# EAGLE design toolbox (EAGLE 7.4.0)
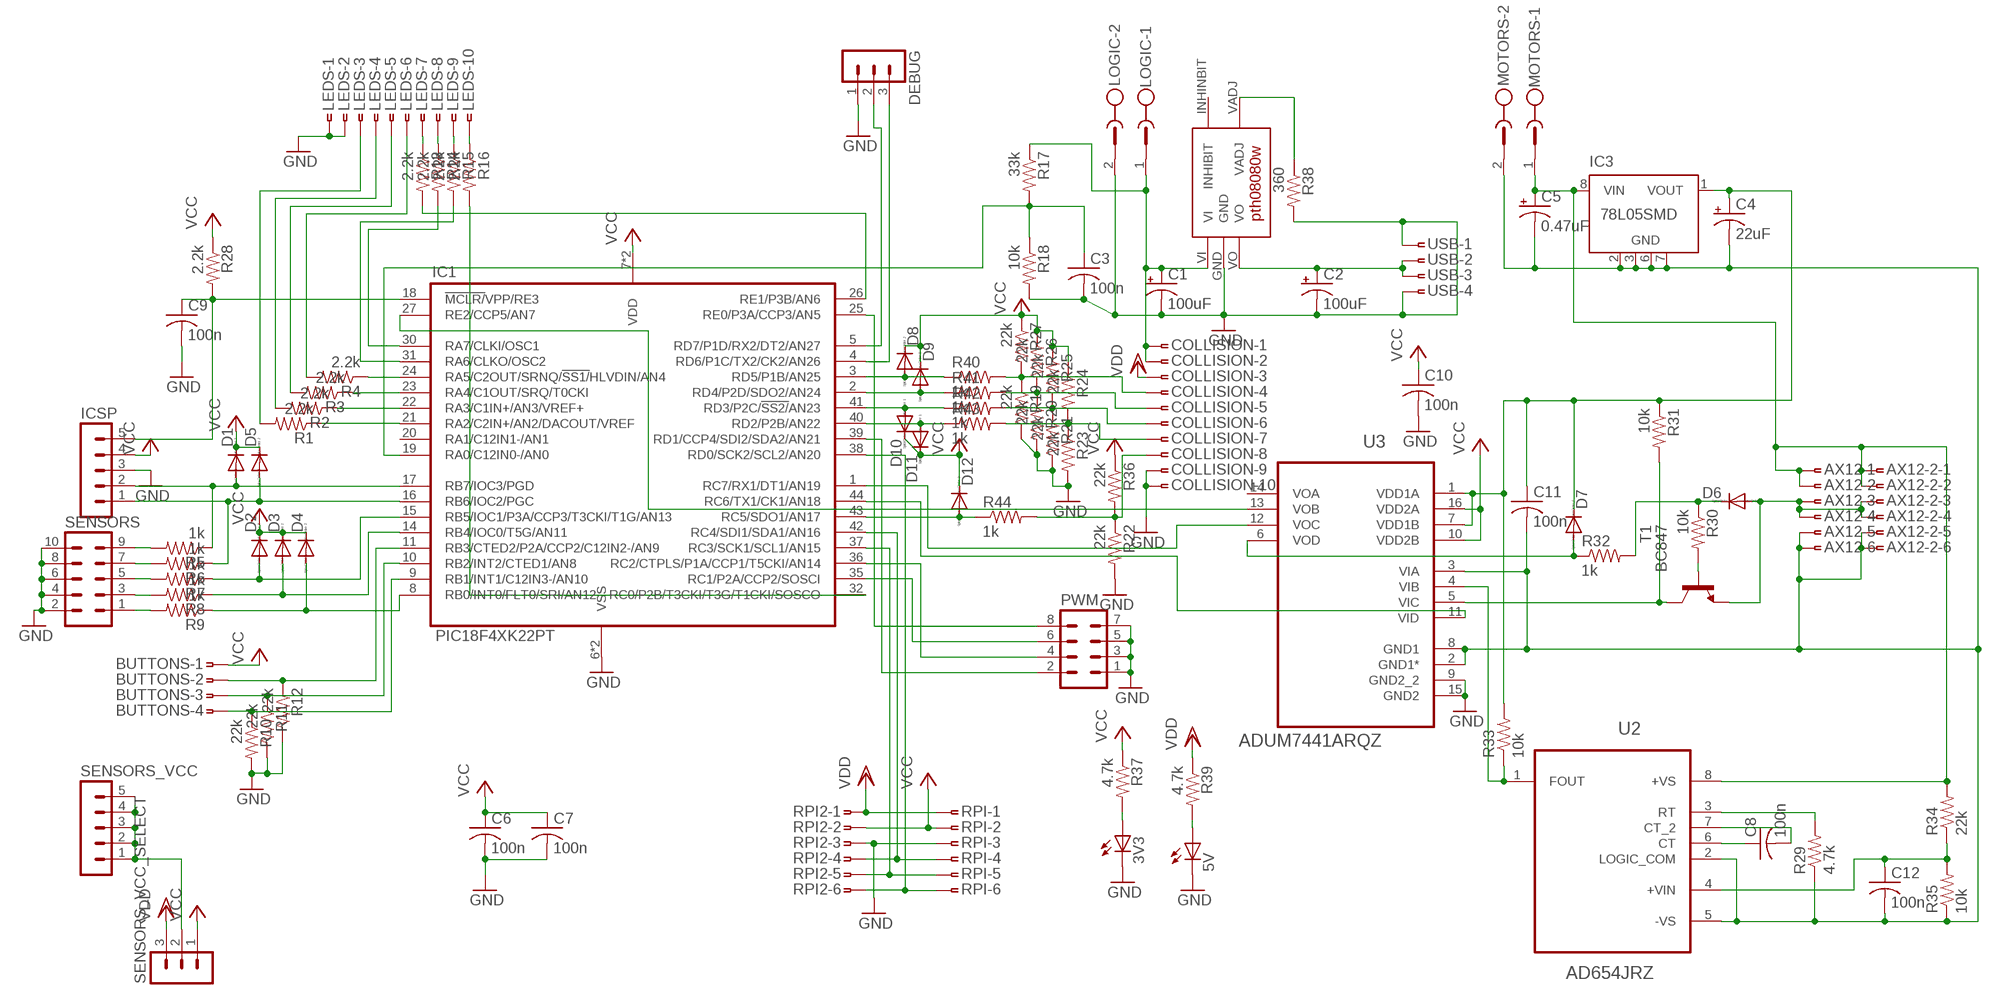
[diagram p0: schematic, sheet 1]

## Parts
3V3  LEDCHIPLED_0805  [CHIPLED_0805]
5V  LEDCHIPLED_0805  [CHIPLED_0805]
AX12  SMDTOP-6  [SMDTOP6]
AX12-2  SMDTOP-6  [SMDTOP6]
BUTTONS  SMDTOP-4  [SMDTOP4]
C1  100uF  CPOL-USE2,5-6E  [E2,5-6E]
C2  100uF  CPOL-USE2,5-6E  [E2,5-6E]
C3  100n  C-USC0805  [C0805]
C4  22uF  CPOL-USE2-5  [E2-5]
C5  0.47uF  CPOL-USE2-5  [E2-5]
C6  100n  C-USC0805  [C0805]
C7  100n  C-USC0805  [C0805]
C8  100n  C-USC0805  [C0805]
C9  100n  C-USC0805  [C0805]
C10  100n  C-USC0805  [C0805]
C11  100n  C-USC0805  [C0805]
C12  100n  C-USC0805  [C0805]
COLLISION  SMDTOP-10  [SMDTOP10]
D1  DIODE-SOD523  [SOD523]
D2  DIODE-SOD523  [SOD523]
D3  DIODE-SOD523  [SOD523]
D4  DIODE-SOD523  [SOD523]
D5  DIODE-SOD523  [SOD523]
D6  DIODE-SOD523  [SOD523]
D7  DIODE-SOD523  [SOD523]
D8  DIODE-SOD523  [SOD523]
D9  DIODE-SOD523  [SOD523]
D10  DIODE-SOD523  [SOD523]
D11  DIODE-SOD523  [SOD523]
D12  DIODE-SOD523  [SOD523]
DEBUG  MA03-1  [MA03-1]
IC1  PIC18F4XK22PT  [TQFP44]
IC3  78L05SMD  [SO08]
ICSP  MA05-1  [MA05-1]
LEDS  SMDTOP-10  [SMDTOP10]
LOGIC  MSTBV2  [MSTBV2]
MOTORS  MSTBV2  [MSTBV2]
PWM  MA04-2  [MA04-2]
R1  2.2k  R-US_M0805  [M0805]
R2  2.2k  R-US_M0805  [M0805]
R3  2.2k  R-US_M0805  [M0805]
R4  2.2k  R-US_M0805  [M0805]
R5  1k  R-US_M0805  [M0805]
R6  1k  R-US_M0805  [M0805]
R7  1k  R-US_M0805  [M0805]
R8  1k  R-US_M0805  [M0805]
R9  1k  R-US_M0805  [M0805]
R10  22k  R-US_M0805  [M0805]
R11  22k  R-US_M0805  [M0805]
R12  22k  R-US_M0805  [M0805]
R13  2.2k  R-US_M0805  [M0805]
R14  2.2k  R-US_M0805  [M0805]
R15  2.2k  R-US_M0805  [M0805]
R16  2.2k  R-US_M0805  [M0805]
R17  33k  R-US_M0805  [M0805]
R18  10k  R-US_M0805  [M0805]
R19  22k  R-US_M0805  [M0805]
R20  22k  R-US_M0805  [M0805]
R21  22k  R-US_M0805  [M0805]
R22  22k  R-US_M0805  [M0805]
R23  22k  R-US_M0805  [M0805]
R24  22k  R-US_M0805  [M0805]
R25  22k  R-US_M0805  [M0805]
R26  22k  R-US_M0805  [M0805]
R27  22k  R-US_M0805  [M0805]
R28  2.2k  R-US_M0805  [M0805]
R29  4.7k  R-US_M0805  [M0805]
R30  10k  R-US_M0805  [M0805]
R31  10k  R-US_M0805  [M0805]
R32  1k  R-US_M0805  [M0805]
R33  10k  R-US_M0805  [M0805]
R34  22k  R-US_M0805  [M0805]
R35  10k  R-US_M0805  [M0805]
R36  22k  R-US_M0805  [M0805]
R37  4.7k  R-US_M0805  [M0805]
R38  360  R-US_M0805  [M0805]
R39  4.7k  R-US_M0805  [M0805]
R40  1k  R-US_M0805  [M0805]
R41  1k  R-US_M0805  [M0805]
R42  1k  R-US_M0805  [M0805]
R43  1k  R-US_M0805  [M0805]
R44  1k  R-US_M0805  [M0805]
RPI  SMDTOP-6  [SMDTOP6]
RPI2  SMDTOP-6  [SMDTOP6]
SENSORS  MA05-2  [MA05-2]
SENSORS_VCC  MA05-1  [MA05-1]
SENSORS_VCC_SELECT  MA03-1  [MA03-1]
T1  BC847  [SOT23]
U2  AD654JRZ  [SOIC127P600X175-8N]
U3  ADUM7441ARQZ  [SOP64P600X175-16N]
U$1  REGUL_PTH  [REGUL_PTH]
USB  SMDTOP-4  [SMDTOP4]

## Nets
GND: 3V3.C 5V.C C1.- C2.- C3.2 C6.2 C7.2 C9.2 C10.2 COLLISION.9 COLLISION.10 DEBUG.1 IC1.6(VSS) IC1.29(VSS) ICSP.3 LEDS.1 LEDS.2 LOGIC.2 PWM.1 PWM.3 PWM.5 PWM.7 R10.2 R11.2 R12.2 R18.2 R19.2 R20.2 R21.2 R22.2 R23.2 R38.2 RPI2.3 RPI.3 SENSORS.2 SENSORS.4 SENSORS.6 SENSORS.8 SENSORS.10 U3.9(GND2_2) U3.15(GND2) U$1.GND USB.1 USB.4
GND_MOTOR: AX12-2.5 AX12-2.6 AX12.5 AX12.6 C4.- C5.- C11.2 C12.2 IC3.2(GND) IC3.3(GND) IC3.6(GND) IC3.7(GND) MOTORS.2 R29.1 R35.1 U2.2(LOGIC_COM) U2.5(-VS) U3.2(GND1*) U3.3(VIA) U3.8(GND1)
N$1: D1.A IC1.17(RB7/IOC3/PGD) ICSP.2 R5.1
N$2: D5.A IC1.16(RB6/IOC2/PGC) ICSP.1 R6.1
N$3: C9.1 IC1.18(!MCLR/!VPP/RE3) ICSP.5 R28.2
N$4: LEDS.6 R4.2
N$5: LEDS.5 R3.2
N$6: LEDS.4 R2.2
N$7: IC1.42(RC4/SDI1/SDA1/AN16) RPI2.4 RPI.4
N$8: IC1.37(RC3/SCK1/SCL1/AN15) RPI2.5 RPI.5
N$9: IC1.38(RD0/SCK2/SCL2/AN20) RPI2.6 RPI.6
N$10: LEDS.3 R1.2
N$11: R5.2 SENSORS.9
N$12: R6.2 SENSORS.7
N$13: R7.2 SENSORS.5
N$14: R8.2 SENSORS.3
N$15: R9.2 SENSORS.1
N$16: D2.A IC1.15(RB5/IOC1/P3A/CCP3/T3CKI/T1G/AN13) R7.1
N$17: D3.A IC1.14(RB4/IOC0/T5G/AN11) R8.1
N$18: D4.A IC1.8(RB0/INT0/FLT0/SRI/AN12) R9.1
N$19: SENSORS_VCC.1 SENSORS_VCC.2 SENSORS_VCC.3 SENSORS_VCC.4 SENSORS_VCC.5 SENSORS_VCC_SELECT.2
N$20: IC1.24(RA5/C2OUT/SRNQ/!SS1/!HLVDIN/AN4) R4.1
N$21: IC1.23(RA4/C1OUT/SRQ/T0CKI) R3.1
N$22: IC1.22(RA3/C1IN+/AN3/VREF+) R2.1
N$23: IC1.21(RA2/C2IN+/AN2/DACOUT/VREF) R1.1
N$24: BUTTONS.4 IC1.9(RB1/INT1/C12IN3-/AN10) R10.1
N$25: BUTTONS.2 IC1.11(RB3/CTED2/P2A/CCP2/C12IN2-/AN9) R12.1
N$26: BUTTONS.3 IC1.10(RB2/INT2/CTED1/AN8) R11.1
N$27: IC1.31(RA6/CLKO/OSC2) R15.2
N$28: IC1.30(RA7/CLKI/OSC1) R14.2
N$29: IC1.32(RC0/P2B/T3CKI/T3G/T1CKI/SOSCO) R16.2
N$30: IC1.26(RE1/P3B/AN6) R13.2
N$31: LEDS.10 R16.1
N$32: LEDS.9 R15.1
N$33: LEDS.8 R14.1
N$34: LEDS.7 R13.1
N$35: C1.+ COLLISION.1 COLLISION.2 LOGIC.1 R17.1 U$1.VI
N$36: DEBUG.2 IC1.5(RD7/P1D/RX2/DT2/AN27)
N$37: C2.+ U$1.VO USB.2 USB.3
N$38: DEBUG.3 IC1.4(RD6/P1C/TX2/CK2/AN26)
N$39: C3.1 IC1.19(RA0/C12IN0-/AN0) R17.2 R18.1
N$40: IC1.35(RC1/P2A/CCP2/SOSCI) PWM.6
N$41: COLLISION.4 R19.1 R27.2 R40.2
N$42: COLLISION.5 R20.1 R26.2 R41.2
N$43: COLLISION.6 R21.1 R25.2 R42.2
N$44: COLLISION.7 R23.1 R24.2 R43.2
N$45: COLLISION.8 R22.1 R36.2 R44.2
N$46: IC1.36(RC2/CTPLS/P1A/CCP1/T5CKI/AN14) PWM.4
N$47: IC1.25(RE0/P3A/CCP3/AN5) PWM.8
N$48: IC1.39(RD1/CCP4/SDI2/SDA2/AN21) PWM.2
N$49: C12.1 R34.1 R35.2 U2.4(+VIN)
N$50: C8.1 U2.6(CT)
N$51: R30.2 T1.1(B)
N$52: AX12-2.3 AX12-2.4 AX12.3 AX12.4 D6.A T1.2(E)
N$53: D6.C R30.1 R32.2
N$54: IC1.1(RC7/RX1/DT1/AN19) U3.12(VOC)
N$55: R31.2 T1.3(C) U3.5(VIC)
N$56: IC1.44(RC6/TX1/CK1/AN18) U3.11(VID)
N$57: IC1.27(RE2/CCP5/AN7) U3.13(VOB)
N$58: R38.1 U$1.VADJ
N$59: D7.A R32.1 U3.6(VOD)
N$60: 3V3.A R37.2
N$61: AX12-2.1 AX12-2.2 AX12.1 AX12.2 C5.+ IC3.8(VIN) MOTORS.1 R34.2 U2.8(+VS)
N$62: C8.2 U2.7(CT_2)
N$63: R33.1 U2.1(FOUT) U3.4(VIB)
N$64: 5V.A R39.2
N$65: R29.2 U2.3(RT)
N$66: D12.A IC1.43(RC5/SDO1/AN17) R44.1
N$67: D8.A IC1.3(RD5/P1B/AN25) R40.1
N$68: C4.+ C11.1 D7.C IC3.1(VOUT) R31.1 R33.2 U3.1(VDD1A) U3.7(VDD1B)
N$69: D9.A IC1.2(RD4/P2D/SDO2/AN24) R41.1
N$70: D10.A IC1.41(RD3/P2C/!SS2/!AN23) R42.1
N$71: D11.A IC1.40(RD2/P2B/AN22) R43.1
VCC: BUTTONS.1 C6.1 C7.1 C10.1 D1.C D2.C D3.C D4.C D5.C D8.C D9.C D10.C D11.C D12.C IC1.7(VDD) IC1.28(VDD) ICSP.4 R24.1 R25.1 R26.1 R27.1 R28.1 R36.1 R37.1 RPI2.2 RPI.2 SENSORS_VCC_SELECT.1 U3.10(VDD2B) U3.16(VDD2A)
VDD: COLLISION.3 R39.1 RPI2.1 RPI.1 SENSORS_VCC_SELECT.3
Unconnected: IC1.20(RA1/C12IN1-/AN1) IC3.4(NC) IC3.5(NC) U3.14(VOA) U$1.INHINBIT(INHIBIT)

## Library data of the parts
3V3 5V = adafruit:LED: LED OSRAM: - CHIPLED LG R971, LG N971, LY N971, LG Q971, LY Q971, LO R971, LY R971 LH N974, LH R974 LS Q976, LO Q976, LY Q976 LO Q996 - Hyper CHIPLED LW Q18S LB Q993, LB Q99A, LB R99A - SideLED LS A670, LO A670, LY A670, LG A670, LP A670 LB A673, LV A673, LT A673, LW A673 LH A674 LY A675 LS A676, LA A676, LO A676, LY A676, LW A676 LS A679, LY A679, LG A679 - Hyper Micro SIDELED® LS Y876, LA Y876, LO Y876, LY Y876 LT Y87S - SmartLED LW L88C, LW L88S LB L89C, LB L89S, LG L890 LS L89K, LO L89K, LY L89K LS L896, LA L896, LO L896, LY L896 - TOPLED LS T670, LO T670, LY T670, LG T670, LP T670 LSG T670, LSP T670, LSY T670, LOP T670, LYG T670 LG T671, LOG T671, LSG T671 LB T673, LV T673, LT T673, LW T673 LH T674 LS T676, LA T676, LO T676, LY T676, LB T676, LH T676, LSB T676, LW T676 LB T67C, LV T67C, LT T67C, LS T67K, LO T67K, LY T67K, LW E67C LS E67B, LA E67B, LO E67B, LY E67B, LB E67C, LV E67C, LT E67C LW T67C LS T679, LY T679, LG T679 LS T770, LO T770, LY T770, LG T770, LP T770 LB T773, LV T773, LT T773, LW T773 LH T774 LS E675, LA E675, LY E675, LS T675 LS T776, LA T776, LO T776, LY T776, LB T776 LHGB T686 LT T68C, LB T68C - Hyper Mini TOPLED® LB M676 - Mini TOPLED Santana® LG M470 LS M47K, LO M47K, LY M47K Source: http://www.osram.convergy.de/
AX12 AX12-2 RPI RPI2 = con-amp:SMDTOP-6: AMP connector
BUTTONS USB = con-amp:SMDTOP-4: AMP connector
C1 C2 C4 C5 = rcl:CPOL-US: POLARIZED CAPACITOR, American symbol
C3 C6-C12 = rcl:C-US: CAPACITOR, American symbol
COLLISION LEDS = con-amp:SMDTOP-10: AMP connector
D1-D12 = diode:DIODE-: DIODE
DEBUG SENSORS_VCC_SELECT = con-lstb:MA03-1: PIN HEADER; OC_FARNELL: unknown; OC_NEWARK: unknown
IC1 = microchip-pic18f4xk22:PIC18F4XK22: The library has been designed by Richard Magdycz <https://www.facebook.com/groups/eaglecadsoftUK>
IC3 = linear:78L*SMD: Positive VOLTAGE REGULATOR
ICSP SENSORS_VCC = con-lstb:MA05-1: PIN HEADER; OC_FARNELL: unknown; OC_NEWARK: unknown
LOGIC MOTORS = con-phoenix-500:MSTBV2: PHOENIX; OC_FARNELL: unknown; OC_NEWARK: unknown
PWM = con-lstb:MA04-2: PIN HEADER; OC_FARNELL: unknown; OC_NEWARK: unknown
R1-R44 = rcl:R-US_: RESISTOR, American symbol
SENSORS = con-lstb:MA05-2: PIN HEADER; OC_FARNELL: unknown; OC_NEWARK: unknown
T1 = transistor:BC847: NPN TRANSISTOR
U2 = AD654:AD654JRZ: Low Cost Monolithic Voltage-to-Frequency Converter; MPN: AD654JRZ; OC_FARNELL: 9605363; OC_NEWARK: 59K4468; PACKAGE: SOIC-8; SUPPLIER: Analog Devices
U3 = ADUM7441:ADUM7441ARQZ: 1 kV RMS Quad-Channel Digital Isolators; MPN: ADUM7441ARQZ; OC_FARNELL: 1827343; OC_NEWARK: 52R8099; PACKAGE: SOP-16; SUPPLIER: Analog Devices
U$1 = regul_pth:REGUL_PTH: "adjustable voltage regulator pth08080w"

## Board
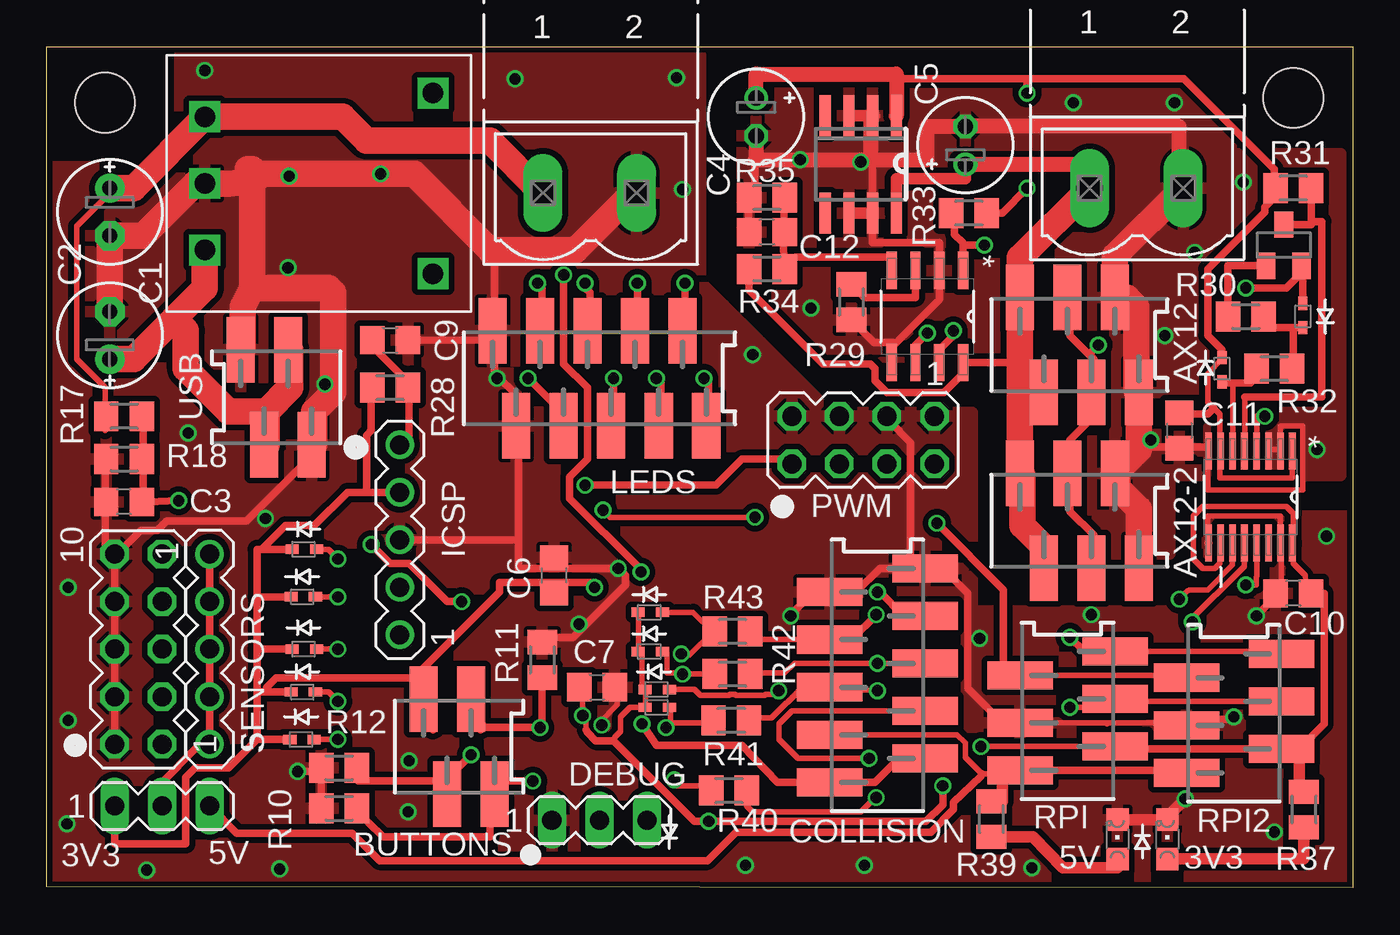
[diagram p1: board, top side]
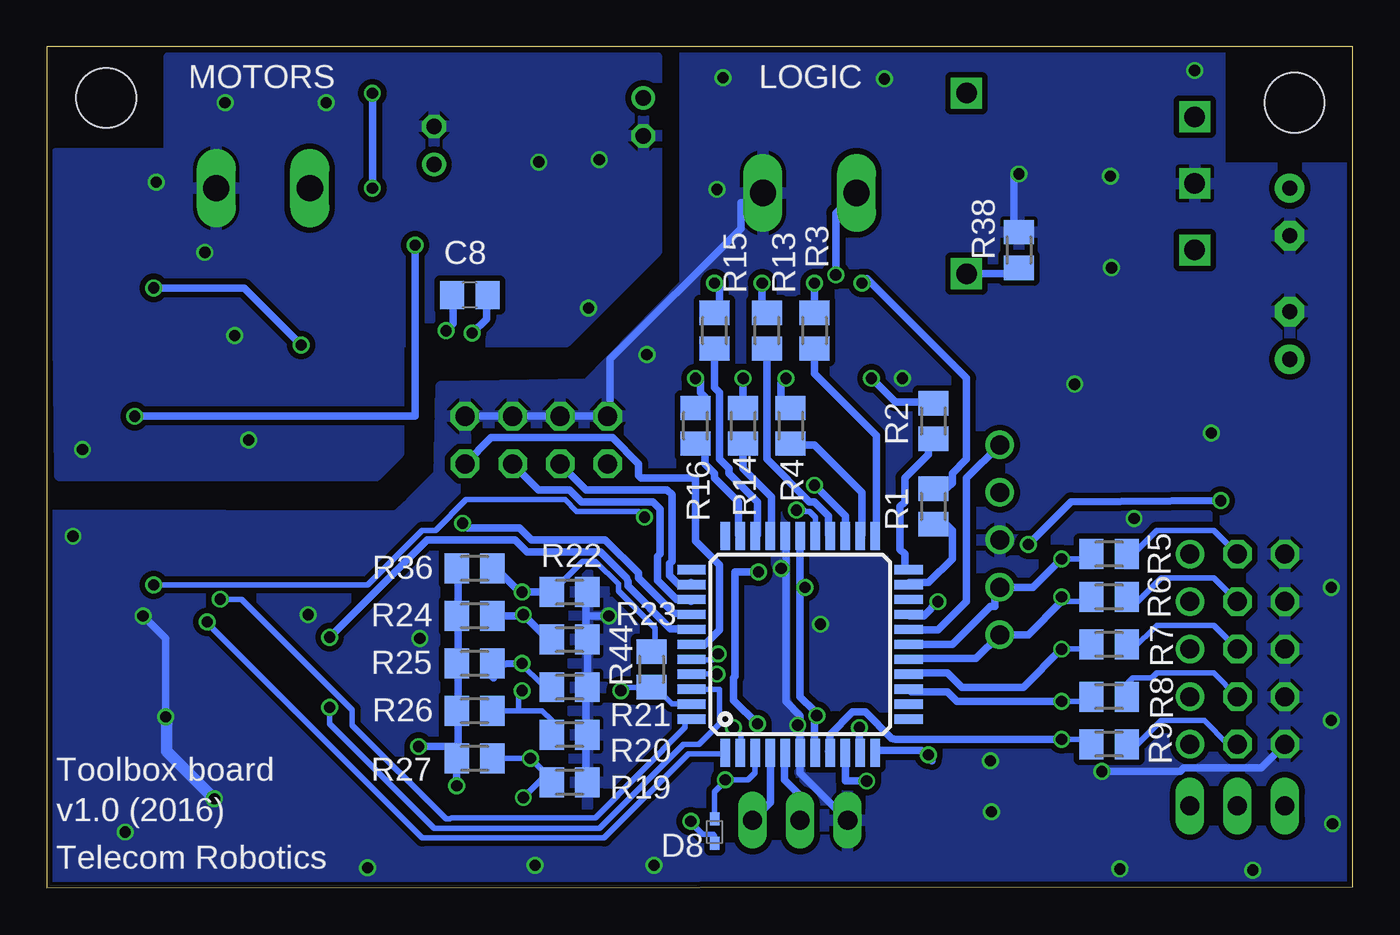
[diagram p2: board, bottom side, seen from below]

Size 69.79 x 44.96 mm. Coordinates in mm from the lower left corner, seen from the top.
Outline: 0,44.96 69.79,44.96 69.79,0 0,0.06 0,44.96
Copper layers (1*16): Top 0.018mm / dielectric 1.55mm / Bottom 0.018mm
Design rules "eurocircuit": minimum track width 0.15mm, minimum drill 0.35mm, track to track 0.15mm, track to pad 0.15mm, pad to pad 0.15mm, via to via 0.15mm, smd to smd 0mil, copper to edge 0.25mm, drill to drill 0.35mm, minimum pad ring 0.175mm, minimum via ring 0.125mm, stop-mask expansion 0mil, vias tented up to drill 0.45mm, thermal gap 0.2mm
Holes 3.2 mm at 3.11,41.97 66.61,42.23

### Footprints (pad centres in the part's own frame; a part is rotated, then mirrored left to right if it is on the bottom)
CHIPLED_0805 = smd 1.2 x 1.2: A 0,-1.05; C 0,1.05
SMDTOP6 = smd 1.5 x 3.5: 1 -3.175,2.54; 2 -1.905,-2.54; 3 -0.635,2.54; 4 0.635,-2.54; 5 1.905,2.54; 6 3.175,-2.54
SMDTOP4 = smd 1.5 x 3.5: 1 -1.905,2.54; 2 -0.635,-2.54; 3 0.635,2.54; 4 1.905,-2.54
E2,5-6E = drill 0.813 pad 1.575: + -1.27,0 | drill 0.813 pad 1.575 octagon: - 1.27,0
C0805 = smd 1.3 x 1.5: 1 -0.95,0; 2 0.95,0
E2-5 = drill 0.813 pad 1.27: + -1.016,0 | drill 0.813 pad 1.27 octagon: - 1.016,0
SMDTOP10 = smd 1.5 x 3.5: 1 -5.715,2.54; 2 -4.445,-2.54; 3 -3.175,2.54; 4 -1.905,-2.54; 5 -0.635,2.54; 6 0.635,-2.54; 7 1.905,2.54; 8 3.175,-2.54; 9 4.445,2.54; 10 5.715,-2.54
SOD523 = smd 0.7 x 0.5: A 0.7,0; C -0.6,0
MA03-1 = drill 1.016 long: 1 -2.54,0; 2 0,0; 3 2.54,0
TQFP44 = smd 1.5 x 0.5: 1 -5.8,4; 2 -5.8,3.2; 3 -5.8,2.4; 4 -5.8,1.6; 5 -5.8,0.8; 6 -5.8,0; 7 -5.8,-0.8; 8 -5.8,-1.6; 9 -5.8,-2.4; 10 -5.8,-3.2; 11 -5.8,-4; 23 5.8,-4; 24 5.8,-3.2; 25 5.8,-2.4; 26 5.8,-1.6; 27 5.8,-0.8; 28 5.8,0; 29 5.8,0.8; 30 5.8,1.6; 31 5.8,2.4; 32 5.8,3.2; 33 5.8,4 | smd 0.5 x 1.5: 12 -4,-5.8; 13 -3.2,-5.8; 14 -2.4,-5.8; 15 -1.6,-5.8; 16 -0.8,-5.8; 17 0,-5.8; 18 0.8,-5.8; 19 1.6,-5.8; 20 2.4,-5.8; 21 3.2,-5.8; 22 4,-5.8; 34 4,5.8; 35 3.2,5.8; 36 2.4,5.8; 37 1.6,5.8; 38 0.8,5.8; 39 0,5.8; 40 -0.8,5.8; 41 -1.6,5.8; 42 -2.4,5.8; 43 -3.2,5.8; 44 -4,5.8
SO08 = smd 0.6 x 2.2: 1 -1.905,-2.6; 2 -0.635,-2.6; 3 0.635,-2.6; 4 1.905,-2.6; 5 1.905,2.6; 6 0.635,2.6; 7 -0.635,2.6; 8 -1.905,2.6
MA05-1 = drill 1.016: 1 -5.08,0; 2 -2.54,0; 3 0,0; 4 2.54,0; 5 5.08,0
MSTBV2 = drill 1.397 long: 1 -2.5,0; 2 2.5,0
MA04-2 = drill 1.016 octagon: 1 -3.81,-1.27; 2 -3.81,1.27; 3 -1.27,-1.27; 4 -1.27,1.27; 5 1.27,-1.27; 6 1.27,1.27; 7 3.81,-1.27; 8 3.81,1.27
M0805 = smd 1.3 x 1.6: 1 -0.95,0; 2 0.95,0
MA05-2 = drill 1.016 octagon: 1 -5.08,-1.27; 2 -5.08,1.27; 3 -2.54,-1.27; 4 -2.54,1.27; 5 0,-1.27; 6 0,1.27; 7 2.54,-1.27; 8 2.54,1.27; 9 5.08,-1.27; 10 5.08,1.27
SOT23 = smd 1 x 1.4: 1 -0.95,-1.1; 2 0.95,-1.1; 3 0,1.1
SOIC127P600X175-8N = smd 1.981 x 0.559: 1 -2.464,1.905; 2 -2.464,0.635; 3 -2.464,-0.635; 4 -2.464,-1.905; 5 2.464,-1.905; 6 2.464,-0.635; 7 2.464,0.635; 8 2.464,1.905
SOP64P600X175-16N = smd 1.981 x 0.356: 1 -2.464,2.235; 2 -2.464,1.6; 3 -2.464,0.965; 4 -2.464,0.33; 5 -2.464,-0.33; 6 -2.464,-0.965; 7 -2.464,-1.6; 8 -2.464,-2.235; 9 2.464,-2.235; 10 2.464,-1.6; 11 2.464,-0.965; 12 2.464,-0.33; 13 2.464,0.33; 14 2.464,0.965; 15 2.464,1.6; 16 2.464,2.235
REGUL_PTH = drill 1.1 square: GND -6.096,1.27; INHINBIT 6.096,6.096; VADJ 6.096,-3.556; VI -6.096,4.826; VO -6.096,-2.286

### Placement (x,y rotation side)
3V3  59.88,2.6 0 top
5V  57.21,2.6 0 top
AX12  55.18,29.02 0 top
AX12-2  55.18,19.62 0 top
BUTTONS  22.03,7.56 0 top
C1  3.37,36.13 270 top
C2  3.37,29.53 90 top
C3  4.13,20.64 180 top
C4  37.91,41.21 270 top
C5  49.09,39.69 90 top
C6  27.11,16.7 90 top
C7  29.4,10.73 0 top
C8  47.18,31.69 180 bottom
C9  18.35,29.27 0 top
C10  66.61,15.75 180 top
C11  60.52,24.45 270 top
C12  38.48,35.05 180 top
COLLISION  44.39,11.37 90 top
D1  13.72,18.1 0 top
D2  13.72,12.76 0 top
D3  13.65,10.48 0 top
D4  13.59,7.94 0 top
D5  13.65,15.56 0 top
D6  67.12,30.54 90 top
D7  62.8,27.75 270 top
D8  34.1,2.98 90 bottom
D9  32.58,9.65 0 top
D10  32.19,12.64 0 top
D11  32.19,14.73 0 top
D12  32.58,10.6 0 top
DEBUG  29.53,3.62 0 top
IC1  29.53,13.02 90 bottom
IC3  43.5,38.67 180 top
ICSP  18.86,18.61 90 top
LEDS  29.53,27.24 0 top
LOGIC  29.02,37.15 0 top
MOTORS  58.23,37.4 0 top
PWM  43.62,23.94 180 top
R1  22.42,20.38 90 bottom
R2  22.42,24.96 90 bottom
R3  28.77,29.78 90 bottom
R4  30.04,24.7 90 bottom
R5  13.02,17.84 0 bottom
R6  13.02,15.56 0 bottom
R7  13.02,13.02 0 bottom
R8  13.02,10.22 0 bottom
R9  13.02,7.68 0 bottom
R10  15.62,4.25 180 top
R11  26.48,12.19 90 top
R12  15.62,6.41 180 top
R13  31.31,29.78 270 bottom
R14  32.58,24.7 270 bottom
R15  34.1,29.78 270 bottom
R16  35.12,24.7 270 bottom
R17  4.13,25.21 0 top
R18  4.13,22.92 180 top
R19  41.85,5.65 0 bottom
R20  41.85,8.19 0 bottom
R21  41.85,10.73 0 bottom
R22  41.85,15.81 0 bottom
R23  41.85,13.27 0 bottom
R24  46.93,14.54 0 bottom
R25  46.93,12 0 bottom
R26  46.93,9.46 0 bottom
R27  46.93,6.92 0 bottom
R28  18.35,26.73 0 top
R29  42.99,31.31 90 top
R30  64.07,30.54 180 top
R31  66.61,37.4 0 top
R32  65.6,27.75 0 top
R33  49.28,36.07 0 top
R34  38.48,33.08 180 top
R35  38.48,36.89 0 top
R36  46.93,17.08 0 bottom
R37  67.18,4.19 270 top
R38  17.84,34.1 90 bottom
R39  50.48,3.68 270 top
R40  36.45,5.21 0 top
R41  36.58,8.95 0 top
R42  36.64,11.43 0 top
R43  36.64,13.72 0 top
R44  37.47,11.68 90 bottom
RPI  54.55,9.46 90 top
RPI2  63.44,9.33 90 top
SENSORS  4.89,12.76 90 top
SENSORS_VCC  8.7,12.76 270 top
SENSORS_VCC_SELECT  6.16,4.38 0 top
T1  66.1,34.35 0 top
U2  47.05,30.54 270 top
U3  64.33,20.89 270 top
U$1  14.54,36.39 0 top
USB  12.26,26.23 180 top

### Tracks (layer width: path | path; a pad name or v marks a point on that pad's centre or on a via)
GND  (via drill 0.6)
  Top 0.305: 62.04,18.43 62.04,19.88 65.93,19.88 U3.15 65.98,18.35 65.98,16.26 65.66,15.24 65.66,15.94 C10.2 | C7.2 30.48,10.92 30.48,9.78 29.53,8.83 v29.65,8.7 | 27.11,17.08 27.11,17.46 26.99,17.59 27.11,17.72 C6.2 | RPI.3 56.58,8.83 56.64,8.76 56.71,8.83 59.63,8.83 | 44.9,25.02 PWM.3 | 46.1,17.27 COLLISION.10
  Top 0.406: U3.9 62.04,18.43 | 3.11,20.64 3.11,22.92 R18.2 | SENSORS.10 3.11,18.35 3.11,20.64 | 3.11,20.64 C3.2 | SENSORS.10 SENSORS.8 SENSORS.6 SENSORS.4 SENSORS.2 | 25.21,24.7 25.21,26.23 23.94,27.5 23.94,29.78 | C9.2 23.18,29.27 23.69,29.78 LEDS.1 23.94,29.78 | 23.94,29.78 23.94,33.59 23.69,34.1 | 25.21,24.7 25.21,18.61 | 25.21,18.61 25.21,17.08 27.11,17.08 v30.54,17.08 30.92,16.7 30.92,16.19 28.13,13.4 26.48,13.4 R11.2 | 25.21,24.7 LEDS.2 | 25.21,18.61 ICSP.3 | COLLISION.10 44.51,17.08 43.24,15.81 COLLISION.9 40.96,15.81 40.01,14.86 40.01,14.73 39.81,14.54 v39.75,14.54 | 59.63,8.83 59.75,8.7 RPI2.3 62.04,8.7 62.36,9.02 63.44,9.02 v63.44,9.14 | v64.64,14.54 65.34,15.24 65.41,15.81 C10.2 | SENSORS.10 3.81,17.91 5.02,19.11 5.91,19.11 6.41,19.62 10.67,19.62 14.03,22.99 USB.1 | COLLISION.10 46.16,17.4 46.16,23.81 45.02,24.96 PWM.3 | COLLISION.10 47.88,17.08 49.21,15.75 49.21,10.67 51.05,8.83 RPI.3 | R10.2 R12.2 14.48,6.22 v13.4,6.22
  Top 0.61: 5V.C 3V3.C 60.01,3.94 v60.83,4.76
  Top 1.422: C2.- C1.- 5.14,34.86 7.94,37.66 U$1.GND 9.72,37.66 11.11,37.78 | 11.11,37.78 11.24,38.16 v17.84,38.16 19.62,38.16 23.69,34.1 28.26,34.1 31.3,37.15 LOGIC.2 | 10.99,32.07 10.99,38.42 10.73,38.42 11.11,37.78 | 10.99,32.07 10.48,31.05 10.48,28.77 USB.4 | USB.1 14.29,23.69 14.29,25.46 15.3,26.48 15.3,31.81 15.05,32.07 10.99,32.07
  Bottom 0.305: v29.65,8.7 29.53,8.7
  Bottom 0.406: R38.2 17.84,34.86 18.1,35.12 18.1,38.16 v17.84,38.16 | 30.29,17.08 30.29,18.61 IC1.29 | 30.29,17.08 30.29,9.97 29.53,9.21 29.53,8.7 IC1.6 29.53,6.16 DEBUG.1 | 30.29,17.08 v30.54,17.08 | PWM.1 PWM.3 PWM.5 PWM.7 39.69,25.34 39.69,28.26 32.7,35.24 32.7,36.64 32.07,36.64 31.69,37.02 LOGIC.2 31.56,37.15 | R19.2 40.96,5.65 40.96,8.19 R20.2 40.96,8.32 40.96,10.73 R21.2 40.89,10.92 40.89,13.08 R23.2 40.96,13.27 40.96,14.54 | 40.96,14.54 40.96,15.81 R22.2 | v63.44,9.14 63.44,13.33 v64.64,14.54 | 40.96,14.54 v39.75,14.54 | v13.4,6.22 9.21,6.22 9.02,6.41 4.89,6.41 SENSORS.2
  Bottom 0.61: v60.83,4.76 63.37,7.3 63.37,8.95 v63.44,9.14
  other vias: 19.37,6.79 19.3,4.06 49.85,13.33 11.68,19.75 1.14,16.07 1.14,8.95 1.08,3.43 5.33,0.95 12.45,1.02 37.34,1.21 43.69,1.21 52.64,1.08 65.6,2.98 55.82,14.6 12.89,33.15 12.95,38.04 8.45,43.69 25.02,43.24 33.66,43.31 37.72,28.51 33.97,37.34 24.07,27.24 28.45,14.1 7.56,24.32 14.86,26.92 68.39,18.8
  pour Bottom (isolate 0.305): 69.47,0.38 69.34,19.94 51.12,19.88 50.36,20.57 48.83,22.1 48.7,26.8 40.89,26.92 35.69,32.26 35.69,44.64 7.11,44.58 7.11,38.48 0.32,38.48 0.32,0.38
  pour Top (isolate 0.305): 0.32,0.32 69.41,0.25 69.41,19.88 61.34,19.88 61.34,14.8 49.47,14.8 49.47,25.4 41.91,25.4 34.92,32.38 34.92,44.51 7.11,44.51 7.11,38.54 0.32,38.54 0.38,0.32
GND_MOTOR  (via drill 0.6)
  Top 0.305: U3.8 62.04,23.36 | 62.04,23.36 62.04,21.27 67.12,21.27 67.12,24.7 65.93,24.7 U3.2 | 62.04,23.36 62.04,23.56 62.04,24.19 | 65.85,23.43 65.34,23.43
  Top 0.406: IC3.2 IC3.7 44.13,34.48 47.69,34.48 U2.2 47.69,31.43 45.4,29.15 | U2.5 45.15,28.89 45.4,29.15 | 37.85,38.93 37.85,36.57 R35.1 37.47,34.8 C12.2 | R29.1 44.2,29.15 45.4,29.15 | 65.34,23.43 U3.3 | 65.85,23.43 U3.2 | 62.04,23.56 60.52,23.56 C11.2 60.39,23.56 58.36,23.56
  Top 0.61: IC3.3 IC3.2 | IC3.7 IC3.6
  Top 0.813: IC3.2 44.01,41.27 44.01,38.93 | 44.01,38.93 47.05,38.93 47.05,40.7 C5.- 60.52,40.7 60.52,37.4 MOTORS.2 | C4.- 37.91,38.93 | 37.91,38.93 37.85,38.93 | 37.91,38.93 v40.26,38.93 44.01,38.93
  Top 1.422: MOTORS.2 57.09,33.76 AX12.5 57.72,31.56 58.23,31.05 58.23,26.61 AX12.6 58.36,23.56 58.36,23.43 AX12-2.5 57.21,22.03 57.21,21.4 58.36,20.26 AX12-2.6
  other vias: 43.5,38.8 54.86,41.97 60.26,41.97 63.94,37.72 61.34,33.97 59.75,29.53 58.99,23.94 67.88,23.43 40.83,30.99
  pour Bottom (isolate 0.305): 37.21,44.39 63.25,44.39 63.25,39.24 69.28,39.24 69.09,22.03 52.2,22.03 50.99,23.24 50.99,29.21 42.04,29.21 37.21,34.04
  pour Top (isolate 0.305): 37.15,44.58 37.15,32.58 41.34,28.38 51.44,28.38 51.5,28.32 51.5,17.84 60.01,17.84 60.01,21.97 60.07,21.97 60.07,22.03 69.15,22.03 69.15,39.24 63.31,39.24 63.31,44.58 37.27,44.58
N$1  (via drill 0.6)
  Top 0.305: v15.56,17.59 15.05,18.1 D1.A
  Bottom 0.305: v15.56,17.59 14.54,17.59 14.03,18.1 13.78,17.84 R5.1
  Bottom 0.406: v15.56,17.59 17.08,16.07 ICSP.2 19.11,15.81 19.11,15.05 19.37,15.05 21.4,13.02 IC1.17
N$2  (via drill 0.6)
  Top 0.305: D5.A v15.56,15.56
  Bottom 0.305: 15.56,15.3 14.03,15.3 13.78,15.56 R6.1
  Bottom 0.406: v15.56,15.56 15.56,15.3 17.34,13.53 ICSP.1 20.13,12.26 23.69,12.26 IC1.16
N$3
  Top 0.406: ICSP.5 19.37,24.19 19.37,26.73 | 19.37,26.73 19.37,26.99 17.34,29.02 17.34,29.27 C9.1 | 19.37,26.73 R28.2
  Bottom 0.406: ICSP.5 20.64,21.91 20.64,15.3 22.16,13.78 23.69,13.78 IC1.18
N$4  (via drill 0.6)
  Top 0.406: v30.29,27.24 30.29,24.7 LEDS.6
  Bottom 0.406: v30.29,27.24 30.54,26.99 30.54,25.97 30.04,25.46 R4.2
N$5  (via drill 0.6)
  Top 0.406: LEDS.5 29.02,29.78 29.02,31.81 28.77,32.07 v28.77,32.32
  Bottom 0.406: v28.77,32.32 28.77,31.05 28.51,30.8 28.77,30.54 R3.2
N$6  (via drill 0.6)
  Top 0.406: v25.72,27.24 27.75,25.21 27.75,24.7 LEDS.4
  Bottom 0.406: v25.72,27.24 24.45,25.97 22.42,25.97 R2.2
N$7  (via drill 0.6)
  Top 0.305: RPI2.4 58.67,9.97 | v54.67,9.65 55.5,9.65 55.94,10.1 RPI.4
  Top 0.406: RPI.4 58.55,10.1 58.67,9.97
  Bottom 0.305: v54.67,9.65 54.67,8.76 49.09,3.17 40.26,3.17 35.75,7.68 34.92,7.68 33.85,8.76 33.85,10.6 35.31,10.6 IC1.42
N$8  (via drill 0.6)
  Top 0.305: RPI.5 59.31,11.37
  Top 0.406: v47.56,19.49 51.12,15.94 51.12,11.49 51.24,11.37 RPI.5 | RPI2.5 59.44,11.24 59.31,11.37
  Bottom 0.406: v47.56,19.49 47.31,19.24 44.51,19.24 43.88,18.61 39.94,18.61 38.16,16.83 38.16,16.57 36.26,14.67 35.37,14.67 IC1.37
N$9  (via drill 0.6)
  Top 0.305: 64.71,12.64 RPI.6
  Top 0.406: v54.67,13.4 55.44,12.64 RPI.6 | 64.71,12.64 64.83,12.51 RPI2.6
  Bottom 0.406: 35.37,13.78 IC1.38 35.56,13.84 36.45,13.84 38.73,16.13 38.73,16.38 38.8,16.57 40.2,17.97 44.13,17.97 44.77,18.61 49.47,18.61 v54.67,13.4
N$10  (via drill 0.6)
  Top 0.406: v26.23,32.32 26.48,32.07 26.48,29.78 LEDS.3
  Bottom 0.406: R1.2 22.42,21.4 21.65,21.4 21.4,21.65 21.4,22.16 20.64,22.92 20.64,27.24 25.97,32.58 v26.23,32.32
N$11
  Bottom 0.305: SENSORS.9 7.43,19.11 10.48,19.11 12,17.59 12.26,17.84 R5.2
N$12
  Bottom 0.305: SENSORS.7 7.43,16.57 10.22,16.57 11.75,15.05 12.26,15.56 R6.2
N$13
  Bottom 0.305: SENSORS.5 7.43,14.03 10.48,14.03 11.75,12.76 12,12.76 12.26,13.02 R7.2
N$14
  Bottom 0.305: SENSORS.3 7.43,11.49 10.48,11.49 10.73,11.24 11.75,11.24 12,10.99 12,10.22 R8.2
N$15
  Bottom 0.305: SENSORS.1 6.67,7.68 7.94,8.95 10.22,8.95 11.75,7.43 12,7.43 12.26,7.68 R9.2
N$16  (via drill 0.6)
  Top 0.305: D2.A v15.56,12.76
  Bottom 0.305: v15.56,12.76 14.03,12.76 13.78,13.02 R7.1
  Bottom 0.406: v15.56,12.76 17.59,10.73 20.89,10.73 21.65,11.49 23.69,11.49 IC1.15
N$17  (via drill 0.6)
  Top 0.305: v15.56,9.97 15.05,10.48 D3.A
  Bottom 0.305: R8.1 13.78,10.22 14.03,10.48 14.54,9.97 v15.56,9.97
  Bottom 0.406: v15.56,9.97 21.14,9.97 21.65,10.48 23.59,10.48 IC1.14
N$18  (via drill 0.6)
  Top 0.305: D4.A v15.56,7.94
  Bottom 0.305: R9.1 13.78,7.68 14.03,7.43 14.54,7.94 v15.56,7.94
  Bottom 0.406: v15.56,7.94 24.45,7.94 24.64,8 26.04,9.4 26.73,9.4 27.94,8.19 27.94,7.49 IC1.8 28,7.29
N$19
  Top 0.406: SENSORS_VCC.1 SENSORS_VCC.2 SENSORS_VCC.3 SENSORS_VCC.4 SENSORS_VCC.5 8.45,7.43 7.94,7.43 6.16,5.65 SENSORS_VCC_SELECT.2
N$20
  Bottom 0.406: IC1.24 26.23,18.86 26.23,21.15 28.77,23.69 30.04,23.69 R4.1
N$21
  Bottom 0.406: R3.1 28.77,27.5 25.46,24.19 25.46,18.86 IC1.23
N$22
  Bottom 0.406: IC1.22 23.94,17.08 23.94,17.84 24.19,18.1 24.19,20.38 23.94,20.64 23.94,21.91 22.67,23.18 22.67,23.94 22.42,24.19 R2.1
N$23
  Bottom 0.406: R1.1 22.42,19.37 21.65,19.37 21.4,19.11 21.4,17.59 22.67,16.32 23.69,16.32 IC1.21
N$24  (via drill 0.6)
  Top 0.406: R10.1 17.21,3.49 17.97,2.73 23.69,2.73 23.69,3.62 23.94,3.87 BUTTONS.4 24.13,5.08 24.07,5.72 v25.97,5.72
  Bottom 0.406: v25.97,5.72 27.11,5.72 27.11,7.18 IC1.9
N$25  (via drill 0.6)
  Top 0.406: v22.67,7.11 21.4,5.84 BUTTONS.2 21.21,5.72 16.64,5.72 16.57,5.78 R12.1
  Bottom 0.406: IC1.11 25.59,7.24 25.46,7.37 23.05,7.37 22.48,6.79 22.48,6.92 v22.67,7.11
N$26  (via drill 0.6)
  Top 0.406: 23.18,9.97 23.18,8.45 BUTTONS.3 23.37,8.57 v26.35,8.57 | 26.48,11.49 R11.1 26.48,8.76 v26.35,8.57 | v26.35,8.57 26.42,8.57
  Bottom 0.406: v26.35,8.57 26.35,7.24 IC1.10
N$27
  Bottom 0.406: R15.2 34.1,29.02 33.85,28.77 34.1,28.51 34.1,26.73 33.85,26.48 33.85,22.92 33.34,22.42 33.34,22.16 31.81,20.64 31.81,18.86 IC1.31
N$28
  Bottom 0.406: R14.2 32.58,22.42 31.05,20.89 31.05,18.86 IC1.30
N$29
  Bottom 0.406: R16.2 35.12,23.69 34.61,23.18 34.61,22.67 34.1,22.16 34.1,21.91 32.83,20.64 32.83,18.86 IC1.32
N$30
  Bottom 0.406: R13.2 31.3,29.02 31.56,28.77 31.3,28.51 31.3,22.92 29.02,20.64 28.77,20.64 28,19.88 28,18.86 IC1.26
N$31  (via drill 0.6)
  Top 0.406: v35.12,27.24 35.37,26.99 35.37,24.7 LEDS.10
  Bottom 0.406: R16.1 35.12,25.46 34.61,25.97 34.61,26.23 34.86,26.48 34.86,27.24 v35.12,27.24
N$32  (via drill 0.6)
  Top 0.406: v34.1,32.32 34.1,29.78 LEDS.9
  Bottom 0.406: R15.1 34.1,30.54 33.85,30.8 33.85,32.32 v34.1,32.32
N$33  (via drill 0.6)
  Top 0.406: v32.58,27.24 32.83,26.99 32.83,24.7 LEDS.8
  Bottom 0.406: v32.58,27.24 R14.1
N$34  (via drill 0.6)
  Top 0.406: LEDS.7 31.56,29.78 31.56,32.07 31.3,32.32 v31.56,32.32
  Bottom 0.406: v31.56,32.32 31.56,30.8 31.3,30.54 R13.1
N$35  (via drill 0.6)
  Top 0.305: C1.+ 3.11,36.89 1.59,35.37 1.59,28.26 3.11,26.73 3.11,24.45 R17.1
  Top 0.406: COLLISION.2 45.53,6.92 44.26,5.65 COLLISION.1 39.05,5.65 37.15,7.62 32.58,7.62 v31.81,8.76 | v27.62,32.77 27.62,28 28.89,26.73 28.89,22.92 27.94,21.97 27.94,20.83 31.62,17.14 31.69,16.95 v31.75,16.89
  Top 1.422: C1.+ 4.64,37.4 U$1.VI 15.81,41.21 17.08,39.94 23.69,39.94 26.48,37.15 LOGIC.1
  Bottom 0.406: v27.62,32.77 27.62,36.07 26.54,37.15 LOGIC.1 | 31.88,16.83 v31.75,16.89 33.02,16.89 33.02,11.3 33.08,11.24 33.08,10.03 v31.81,8.76
N$36
  Bottom 0.406: DEBUG.2 29.53,4.95 30.35,5.78 30.35,7.18 IC1.5
N$37
  Top 1.422: 6.79,30.42 4.64,28.26 C2.+ | 6.79,30.42 8.45,32.07 U$1.VO | 11.75,25.46 11.75,23.69 USB.3 | 11.75,25.46 13.02,26.73 13.02,28.77 USB.2 | 11.75,25.46 9.72,25.46 7.43,27.75 7.43,29.78 6.79,30.42
N$38
  Bottom 0.406: DEBUG.3 31.11,4.57 31.11,7.18 IC1.4
N$39  (via drill 0.6)
  Top 0.406: 5.14,22.92 5.14,25.21 R17.2 | 5.14,22.92 5.14,20.64 C3.1 4.89,20.64 5.14,20.38 5.4,20.64 v7.05,20.7 | 5.14,22.92 R18.1 | v17.34,18.35 18.35,17.34 19.37,17.34 21.4,15.3 v22.16,15.3
  Bottom 0.406: v7.05,20.7 15.05,20.64 v17.34,18.35 | v22.16,15.3 22.92,14.54 23.69,14.54 IC1.19
N$40
  Bottom 0.406: 35.37,16.32 IC1.35 35.5,16.19 36.01,16.19 36.51,16.7 36.51,17.34 36.39,17.46 36.39,21.02 36.64,21.27 40.96,21.27 PWM.6
N$41  (via drill 0.6)
  Top 0.305: COLLISION.4 39.81,9.46 39.12,8.76 39.12,7.94 40.13,6.92 v43.94,6.92 | R40.2 37.4,4.38 37.72,4.06 43.5,4.06 44.26,4.83 v44.32,4.83
  Bottom 0.305: 43.05,5.97 R19.1 | R19.1 43.12,6.1 v43.94,6.92 45.91,6.92 45.97,6.98 46.04,6.92 R27.2 | v44.32,4.83 43.18,5.97 R19.1
N$42  (via drill 0.6)
  Top 0.305: v44.39,10.54 43.12,10.6 42.99,10.73 COLLISION.5 40.39,10.73 38.73,9.08 37.59,9.08 37.47,8.95 R41.2
  Bottom 0.305: 44.58,9.46 43.31,9.46 42.8,8.95 R20.1 | 44.58,9.46 R26.2 | 44.58,9.46 44.58,10.6 v44.39,10.54
N$43  (via drill 0.6)
  Top 0.305: 46.55,12 v44.39,12 39.94,12 39.43,11.49 37.59,11.49 37.53,11.43 R42.2
  Top 0.406: COLLISION.6 46.55,12
  Bottom 0.305: v44.39,12 44.32,11.87 43.37,10.92 42.99,10.99 43.18,11.37 R21.1
  Bottom 0.406: 42.99,11.3 42.74,11.11 42.74,10.73 R21.1 | R25.2 46.04,12 46.04,11.37 45.91,11.24 46.1,11.94 v44.39,12
N$44  (via drill 0.6)
  Top 0.305: COLLISION.7 37.66,13.27 37.59,13.33 R43.2
  Top 0.406: v44.32,14.6 43.05,13.33 COLLISION.7
  Bottom 0.406: 44.26,14.54 R24.2 | 44.26,14.54 42.86,13.14 42.74,13.14 42.74,13.27 R23.1 | v44.32,14.6 44.26,14.54
N$45  (via drill 0.6)
  Top 0.406: COLLISION.8 45.78,14.54 44.51,15.81 v44.39,15.81
  Bottom 0.305: R22.1 42.67,15.94 41.15,17.46 40.45,17.46 39.24,16.26 39.24,15.88 37.27,13.91 37.27,12.7 37.34,12.64 37.66,12.64 R44.2
  Bottom 0.406: R22.1 v44.39,15.81 44.51,15.81 45.91,17.21 46.04,17.21 46.04,17.08 R36.2
N$46
  Bottom 0.406: 35.37,15.3 IC1.36 35.5,15.43 36.13,15.43 37.15,16.45 37.15,17.72 37.02,17.84 37.02,20.26 37.4,20.64 41.21,20.64 41.85,21.27 43.5,21.27 PWM.4
N$47  (via drill 0.6)
  Top 0.406: PWM.8 39.56,22.92 37.15,22.92 35.75,21.53 v28.77,21.53
  Bottom 0.406: v28.77,21.53 27.11,19.88 27.11,18.86 IC1.25
N$48
  Bottom 0.406: IC1.39 34.61,13.02 33.85,13.78 33.85,17.27 35.12,18.54 35.12,21.91 38.04,21.91 38.16,22.03 38.16,22.67 39.56,24.07 46.04,24.07 PWM.2
N$49
  Top 0.254: C12.1 39.37,34.8 39.37,34.29
  Top 0.406: R35.2 39.37,34.29 R34.1 40,33.72 45.15,33.72 U2.4
N$50  (via drill 0.6)
  Top 0.406: U2.6 46.42,29.02 v47.05,29.65
  Bottom 0.406: v47.05,29.65 46.29,30.42 46.29,31.69 C8.1
N$51
  Top 0.406: T1.1 63.12,33.25 R30.2
N$52  (via drill 0.6)
  Top 0.406: D6.A 67.12,33.25 T1.2 67.25,33.08 66.23,32.07 v64.07,32.07 | 54.67,22.16 54.67,20.13 55.94,18.86 55.94,17.08 AX12-2.4 | 55.94,26.48 55.94,25.21 54.67,23.94 54.67,22.16 | 54.67,22.16 AX12-2.3 | 55.69,28.51 55.94,28.26 55.94,26.48 | 55.69,28.51 54.67,29.53 54.67,31.56 AX12.3 | 55.94,26.48 AX12.4 | 55.69,28.51 v56.2,29.02
  Bottom 0.406: v64.07,32.07 59.24,32.07 v56.2,29.02
N$53
  Top 0.406: R30.1 64.51,29.94 66.61,29.94 | 66.61,29.94 D6.C | 66.61,29.94 66.61,27.75 R32.2
N$54  (via drill 0.6)
  Top 0.305: U3.12 63.99,17.2 60.96,14.16 v61.21,14.22
  Bottom 0.305: v61.21,14.22 61.28,14.22 49.72,2.67 40.01,2.67 35.5,7.18 33.59,7.18 33.53,7.11 33.47,7.18 IC1.1
N$55
  Top 0.305: U3.5 64.01,26.23
  Top 0.406: T1.3 67.56,35.45 67.56,35.62 | 67.56,35.62 R31.2 | 64.01,26.23 68.14,26.23 68.14,35.62 67.56,35.62
N$56  (via drill 0.6)
  Top 0.305: U3.11 63.36,17.26 62.04,15.94 61.09,15.94 60.96,15.88 v60.52,15.43
  Bottom 0.305: IC1.44 35.37,9.02 35.5,9.08 35.69,9.02 35.69,8.57 40.45,3.75 48.13,3.75 48.26,3.68 48.45,3.68 53.47,8.7 53.47,9.52 59.37,15.43 v60.52,15.43
N$57  (via drill 0.6)
  Top 0.305: U3.13 64.66,16.71 64.64,16.57 64.64,16.19 v64.07,16.19 | v37.85,19.81 30.1,19.81 v29.72,20.19
  Bottom 0.305: v64.07,16.19 52.64,16.19 49.72,19.11 49.02,19.11 47.37,20.76 42.1,20.76 41.47,20.13 38.16,20.13 v37.85,19.81 | v29.72,20.19 29.34,20.19 29.27,20.13 29.02,20.13 28.7,19.81 28.7,18.86 IC1.27
N$58
  Bottom 0.406: U$1.VADJ 17.84,32.83 R38.1
N$59
  Top 0.305: U3.6 63.37,23.36 63.37,26.99
  Top 0.406: D7.A 62.8,26.99 63.37,26.99 64.33,26.99 64.58,27.24 64.58,27.75 R32.1
N$60
  Top 0.61: 3V3.A 67.18,1.55 R37.2
N$61
  Top 0.406: 52.07,27.69 51.68,28.08 U2.8 48.96,27.5 47.94,26.48 44.9,26.48 44.26,27.11 44.26,27.75 44.01,28 41.47,28 37.53,31.94 R34.2
  Top 0.61: IC3.8 45.4,37.91 49.09,37.91 C5.+
  Top 0.813: C5.+ 55.48,38.67 MOTORS.1
  Top 1.422: MOTORS.1 52.01,33.68 AX12.1 52.01,27.75 | AX12.2 52.07,27.69 52.01,27.75 | 52.01,27.75 AX12-2.1 52.13,22.03 52.13,19.37 53.28,18.22 AX12-2.2
N$62  (via drill 0.6)
  Top 0.406: U2.7 47.69,28.77 48.45,29.53 v48.45,29.78
  Bottom 0.406: v48.45,29.78 48.07,30.16 48.07,31.69 C8.2
N$63  (via drill 0.6)
  Top 0.305: U3.4 64.66,25.21 v65.09,25.21
  Top 0.406: U2.1 48.96,34.35 | 48.96,34.35 v50.1,34.35 | 48.96,34.35 48.96,34.48 48.51,34.92 48.51,36.01 R33.1
  Bottom 0.406: v65.09,25.21 50.1,25.21 v50.1,34.35
N$64
  Top 0.61: R39.2 52.7,2.73 54.29,1.08 57.21,1.08 5V.A
N$65
  Top 0.406: R29.2 43.69,31.56 46.42,31.56 U2.3
N$66  (via drill 0.6)
  Top 0.305: D12.A 34.61,10.6 34.92,10.29 36.45,10.29 36.51,10.35 36.77,10.35 36.83,10.29 38.35,10.29 38.42,10.35 38.99,10.35 39.12,10.48 v39.12,10.54
  Bottom 0.305: IC1.43 35.37,9.84 36.39,9.84 37.27,10.73 37.66,10.73 R44.1 37.78,10.73 38.8,10.73 38.99,10.54 v39.12,10.54
N$67  (via drill 0.6)
  Top 0.305: R40.1 35.5,5.4 35.43,5.46 33.53,5.46 v33.53,5.78
  Bottom 0.305: IC1.3 31.94,7.18 31.94,6.16 32.32,5.78 v33.53,5.78 33.59,5.65 34.1,5.14 D8.A
N$68  (via drill 0.6)
  Top 0.305: 62.8,28.77 D7.C 62.8,28.26 62.04,27.5 62.04,25.97 62.36,25.65 62.67,25.34 62.67,23.48 | 62.67,23.48 62.67,21.91 66.56,21.91 U3.1 | U3.7 62.67,23.48
  Top 0.406: 52.39,43.24 60.77,43.24 65.6,38.42 65.6,37.4 | 52.39,43.24 45.4,43.24 | 62.8,28.77 62.04,29.53 62.04,33.08 65.09,36.13 65.09,36.39 65.6,36.89 65.6,37.4 | 65.6,37.4 R31.1 | 52.39,37.15 v52.39,37.4 51.05,36.07 R33.2 | 52.39,43.24 v52.39,42.48 | 62.36,25.65 62.04,25.34 60.52,25.34 C11.1
  Top 0.813: C4.+ 37.91,43.5 45.4,43.5 45.4,43.24 IC3.1
  Bottom 0.406: v52.39,42.48 v52.39,37.4
N$69  (via drill 0.6)
  Top 0.305: R41.1 35.69,8.95 35.56,8.83 33.34,8.83 v33.08,8.57 33.34,8.95 33.34,9.65 D9.A
  Bottom 0.305: v33.08,8.57 32.7,8.19 32.7,7.24 IC1.2
N$70  (via drill 0.6)
  Top 0.305: R42.1 35.75,11.43 35.69,11.49 35.62,11.43 v33.97,11.43 33.85,11.49 33.15,11.49 33.15,12.57 33.08,12.64 D10.A
  Bottom 0.305: IC1.41 35.31,11.43 34.23,11.43 34.16,11.37 33.97,11.37 v33.97,11.43
N$71  (via drill 0.6)
  Top 0.305: 35.59,13.68 35.69,13.78 35.75,13.72 R43.1 | 35.59,13.68 34.35,12.45 33.85,12.45 v33.91,12.51 | 35.59,13.68 34.54,14.73 D11.A
  Bottom 0.305: v33.91,12.51 34.23,12.19 35.31,12.19 IC1.40
VCC  (via drill 0.6)
  Top 0.305: U3.10 62.67,18.35 62.67,17.34 62.42,17.08 61.78,17.08 61.28,17.59 61.28,19.88 61.78,20.38 66.23,20.38 66.61,20 66.61,18.48 U3.16 66.61,18.35 66.61,17.34 67.25,16.7 67.31,16.07 C10.1 | C7.1 28.64,10.86 28.64,9.33 28.77,9.21 v28.64,9.21 28.83,9.08 28.83,8.45 | 27.11,16.32 27.11,15.94 27.24,15.81 27.11,15.68 C6.1 | v49.91,7.56 RPI.2 | 30.29,7.87 30.35,8.06 30.67,8.38 30.67,9.14 31.18,9.65 D9.C 32,9.72 32,10.67 D12.C 31.94,10.54 31.81,10.6 31.81,12.64 D10.C 31.62,12.76 31.62,14.8 31.56,14.8 D11.C
  Top 0.406: 11.24,15.56 11.24,18.1 D1.C 11.49,18.1 12.76,19.37 14.29,19.37 16.07,21.15 17.08,21.15 | 11.24,15.56 11.24,12.76 | 11.24,15.56 D5.C | 11.24,12.76 11.24,10.48 | 11.24,12.76 D2.C | 11.24,10.48 11.24,7.94 | 11.24,10.48 D3.C 11.75,10.48 11.75,10.73 12.26,11.24 19.62,11.24 19.81,11.43 | 17.08,21.15 ICSP.4 | 17.08,21.15 17.08,24.19 17.34,24.45 17.34,26.73 R28.1 | SENSORS_VCC_SELECT.1 3.62,2.35 7.43,2.35 7.43,5.91 7.94,6.41 9.72,6.41 11.24,7.94 | 11.24,7.94 D4.C | 19.81,11.43 24.19,15.81 24.19,16.32 27.11,16.32 29.02,16.32 v29.27,16.07 | 20.64,8.45 BUTTONS.1 20.13,11.11 19.81,11.43 | RPI.2 58.55,7.56 58.67,7.43 RPI2.2 66.93,7.43 68.26,8.76 68.26,15.75 C10.1 | 28.83,8.45 28.89,8.32 29.34,7.87 30.29,7.87 34.61,3.56 v35.37,3.56 46.99,3.56 47.88,4.44 v47.88,5.46
  Top 0.61: R37.1 66.93,5.14 66.93,7.43
  Bottom 0.305: v28.64,9.21 28.77,9.21 | D8.C 34.1,2.79 34.16,2.86 34.73,2.86 35.43,3.56 v35.37,3.56
  Bottom 0.406: 29.53,16.07 29.53,10.22 28.77,9.46 28.77,9.21 28.77,7.43 IC1.7 | 29.53,16.07 IC1.28 | 29.53,16.07 v29.27,16.07 | R36.1 47.82,17.08 47.82,14.54 R24.1 47.82,14.41 47.82,12 R25.1 47.82,11.87 47.82,9.59 R26.1 47.82,9.46 47.82,6.92 R27.1 | v49.91,7.56 48.01,7.56 R27.1 | v47.88,5.46 47.88,6.73 R27.1
VDD
  Top 0.305: COLLISION.3 48.64,8.19 49.09,7.75 49.09,6.98 49.97,6.1 51.05,6.1 RPI.1
  Top 0.406: RPI.1 59.63,6.29 59.75,6.16 RPI2.1 | COLLISION.3 40.89,8.19 | SENSORS_VCC_SELECT.3 10.16,2.92 16.32,2.92 17.78,1.46 35.31,1.46 36.83,2.98 47.24,2.98 48.45,4.19 48.45,4.57 49.91,5.97 49.97,6.1
  Top 0.61: R39.1 51.05,4.63 51.05,6.1

### Text on the board
tNames: 3V3 | 5V
bNames: Toolbox board | v1.0 (2016) | Telecom Robotics